# EAGLE schematic display_breakout (EAGLE 8.3.1)
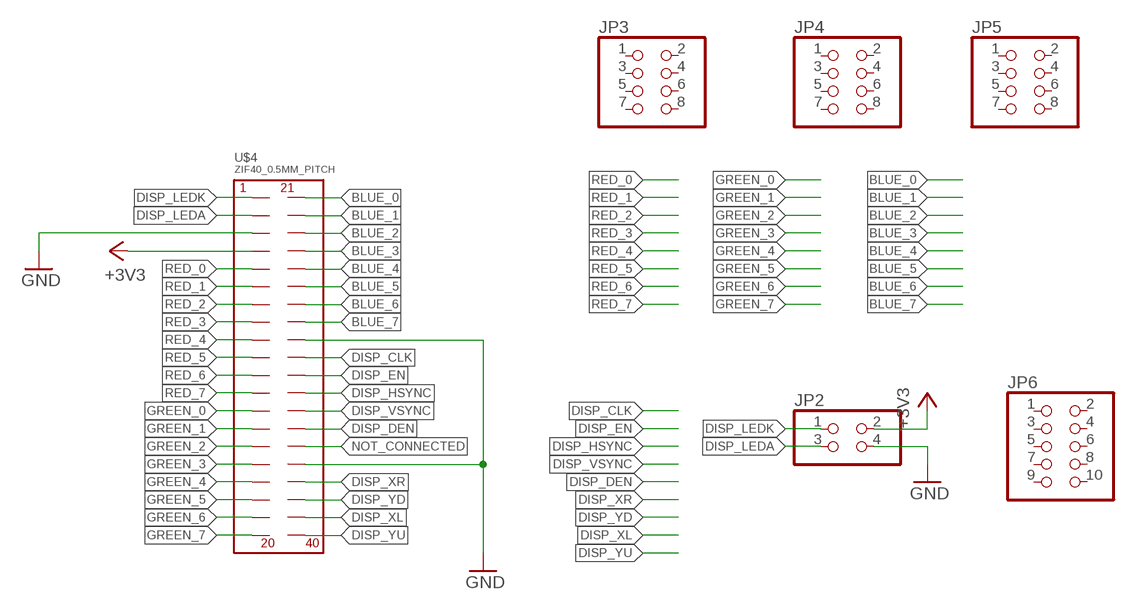
[diagram p0: schematic, sheet 1]

## Parts
JP2  PINHD-2X2  [2X02]
JP3  PINHD-2X4  [2X04]
JP4  PINHD-2X4  [2X04]
JP5  PINHD-2X4  [2X04]
JP6  PINHD-2X5  [2X05]
U$4  ZIF40_0.5MM_PITCH  [ZIF40]

## Nets
+3V3: JP2.2 U$4.P$4
BLUE_0: U$4.P$21
BLUE_1: U$4.P$22
BLUE_2: U$4.P$23
BLUE_3: U$4.P$24
BLUE_4: U$4.P$25
BLUE_5: U$4.P$26
BLUE_6: U$4.P$27
BLUE_7: U$4.P$28
DISP_CLK: U$4.P$30
DISP_DEN: U$4.P$34
DISP_EN: U$4.P$31
DISP_HSYNC: U$4.P$32
DISP_LEDA: JP2.3 U$4.P$2
DISP_LEDK: JP2.1 U$4.P$1
DISP_VSYNC: U$4.P$33
DISP_XL: U$4.P$39
DISP_XR: U$4.P$37
DISP_YD: U$4.P$38
DISP_YU: U$4.P$40
GND: JP2.4 U$4.P$3 U$4.P$29 U$4.P$36
GREEN_0: U$4.P$13
GREEN_1: U$4.P$14
GREEN_2: U$4.P$15
GREEN_3: U$4.P$16
GREEN_4: U$4.P$17
GREEN_5: U$4.P$18
GREEN_6: U$4.P$19
GREEN_7: U$4.P$20
NOT_CONNECTED: U$4.P$35
RED_0: U$4.P$5
RED_1: U$4.P$6
RED_2: U$4.P$7
RED_3: U$4.P$8
RED_4: U$4.P$9
RED_5: U$4.P$10
RED_6: U$4.P$11
RED_7: U$4.P$12
Unconnected: JP3.1 JP3.2 JP3.3 JP3.4 JP3.5 JP3.6 JP3.7 JP3.8 JP4.1 JP4.2 JP4.3 JP4.4 JP4.5 JP4.6 JP4.7 JP4.8 JP5.1 JP5.2 JP5.3 JP5.4 JP5.5 JP5.6 JP5.7 JP5.8 JP6.1 JP6.2 JP6.3 JP6.4 JP6.5 JP6.6 JP6.7 JP6.8 JP6.9 JP6.10

## Library data of the parts
JP2 = Headers_IFE:PINHD-2X2: PIN HEADER
JP3-JP5 = Headers_IFE:PINHD-2X4: PIN HEADER
JP6 = Headers_IFE:PINHD-2X5: PIN HEADER
U$4 = Connectors:ZIF40_0.5MM_PITCH: 40 Pin 0.5mm ptch FPC Connector http://www.buydisplay.com/default/40-pin-0-5mm-pitch-top-contact-zif-connector-fpc-connector